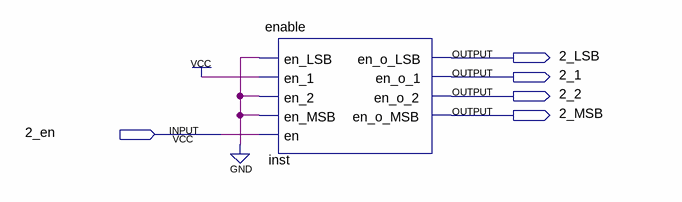
[diagram p0: schematic sheet]
// Quartus schematic 2_en.bdf as structural Verilog: 1 symbols, 5 pins
module \2_en  (
  input  \2_en ,
  output \2_LSB ,
  output \2_1 ,
  output \2_2 ,
  output \2_MSB 
);

  enable inst (
    .en_LSB(1'b0), .en_1(1'b1), .en_2(1'b0), .en_MSB(1'b0), .en(\2_en ), .en_o_LSB(\2_LSB ), .en_o_1(\2_1 ),
    .en_o_2(\2_2 ), .en_o_MSB(\2_MSB ));
endmodule
